# EAGLE schematic zephyreye_rev2 (EAGLE 5.06)
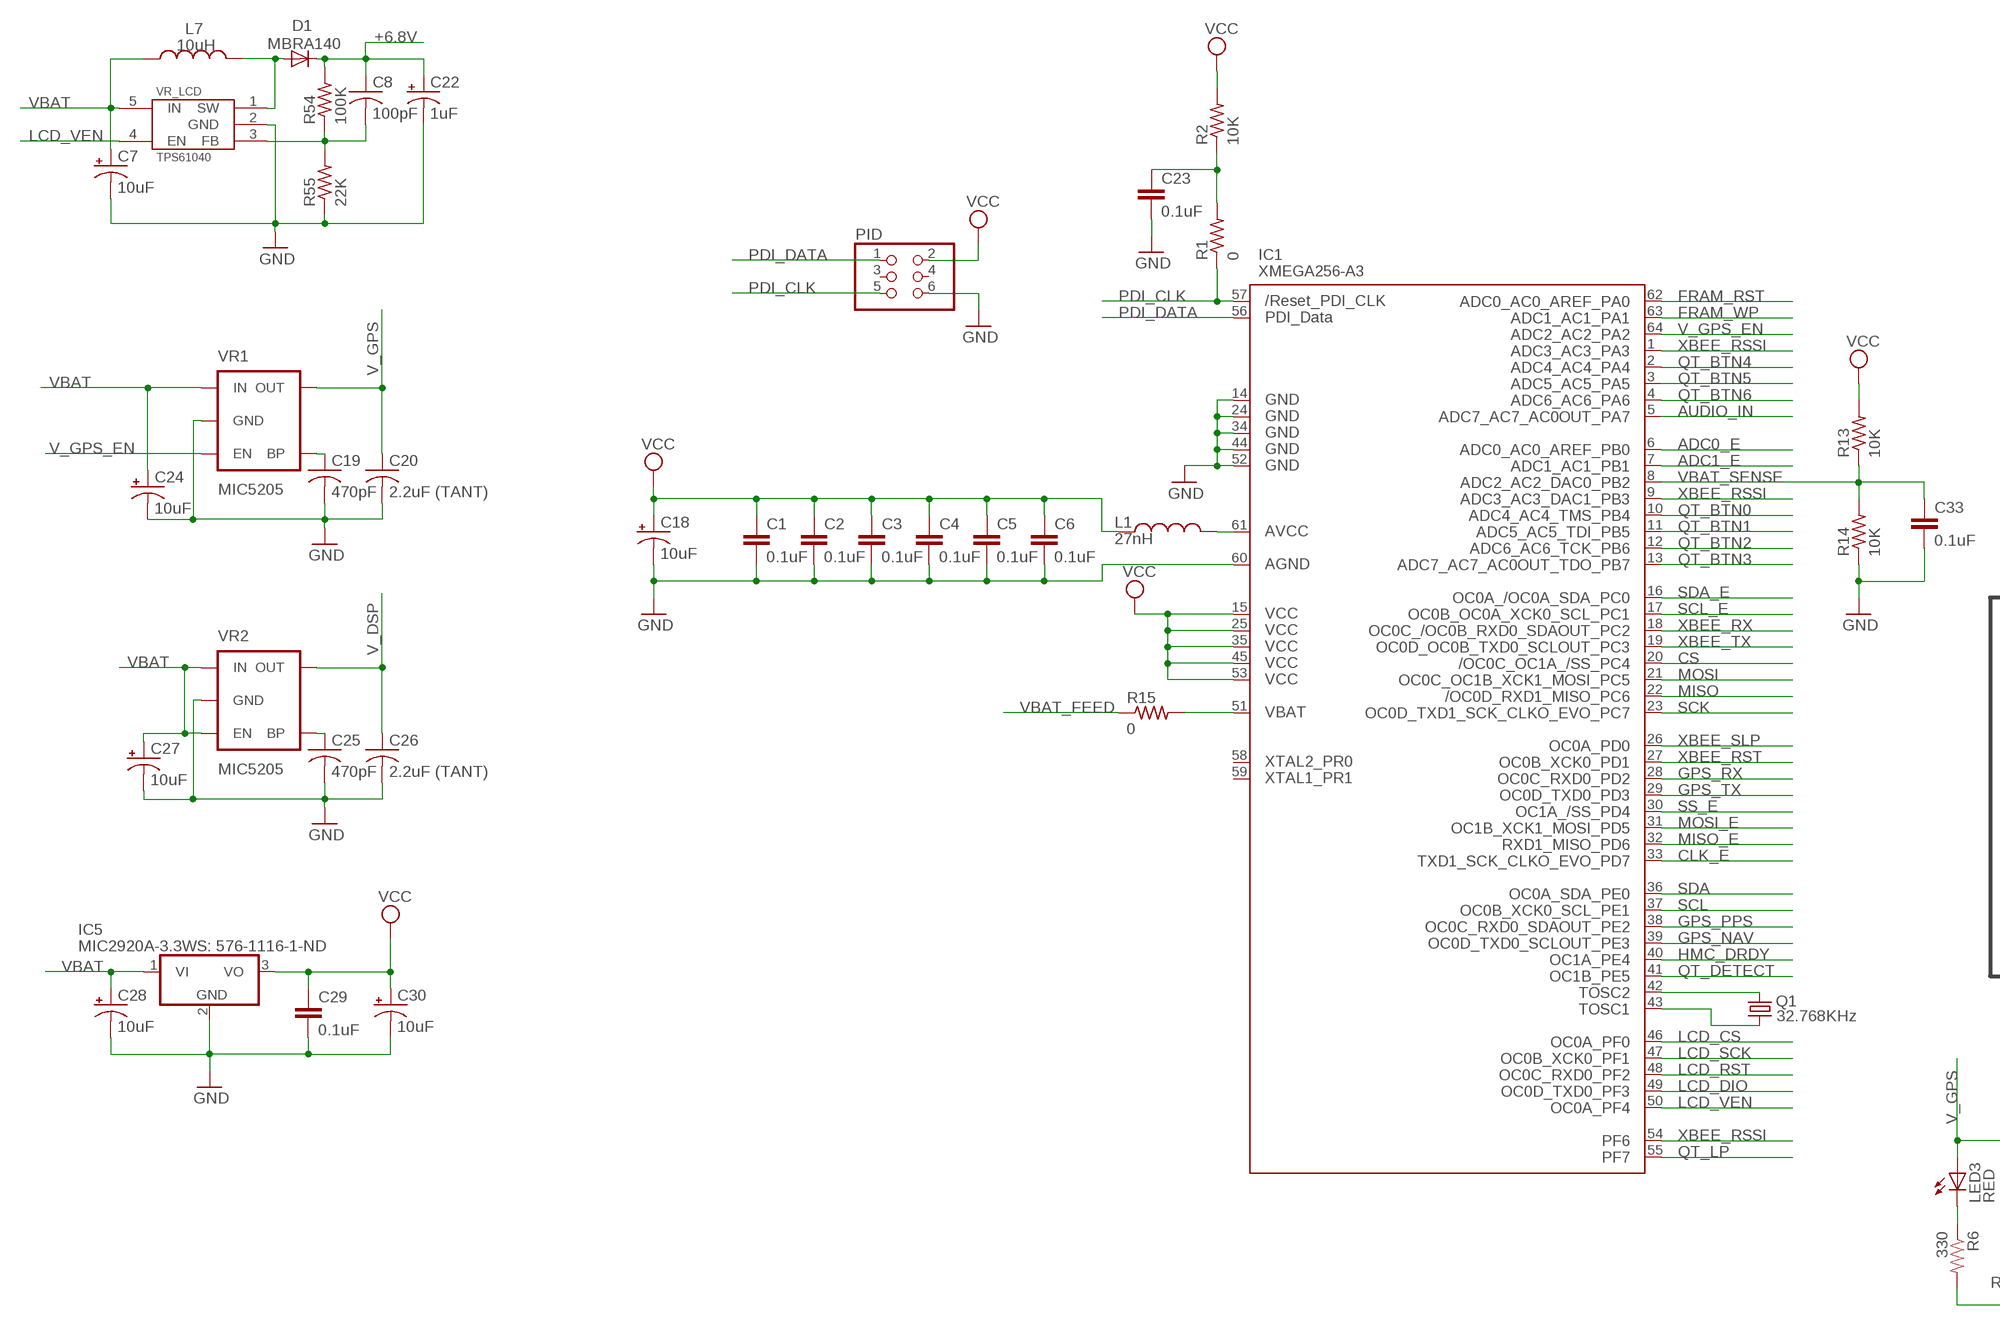
[diagram p0: schematic, sheet 1, part 1 of 2]
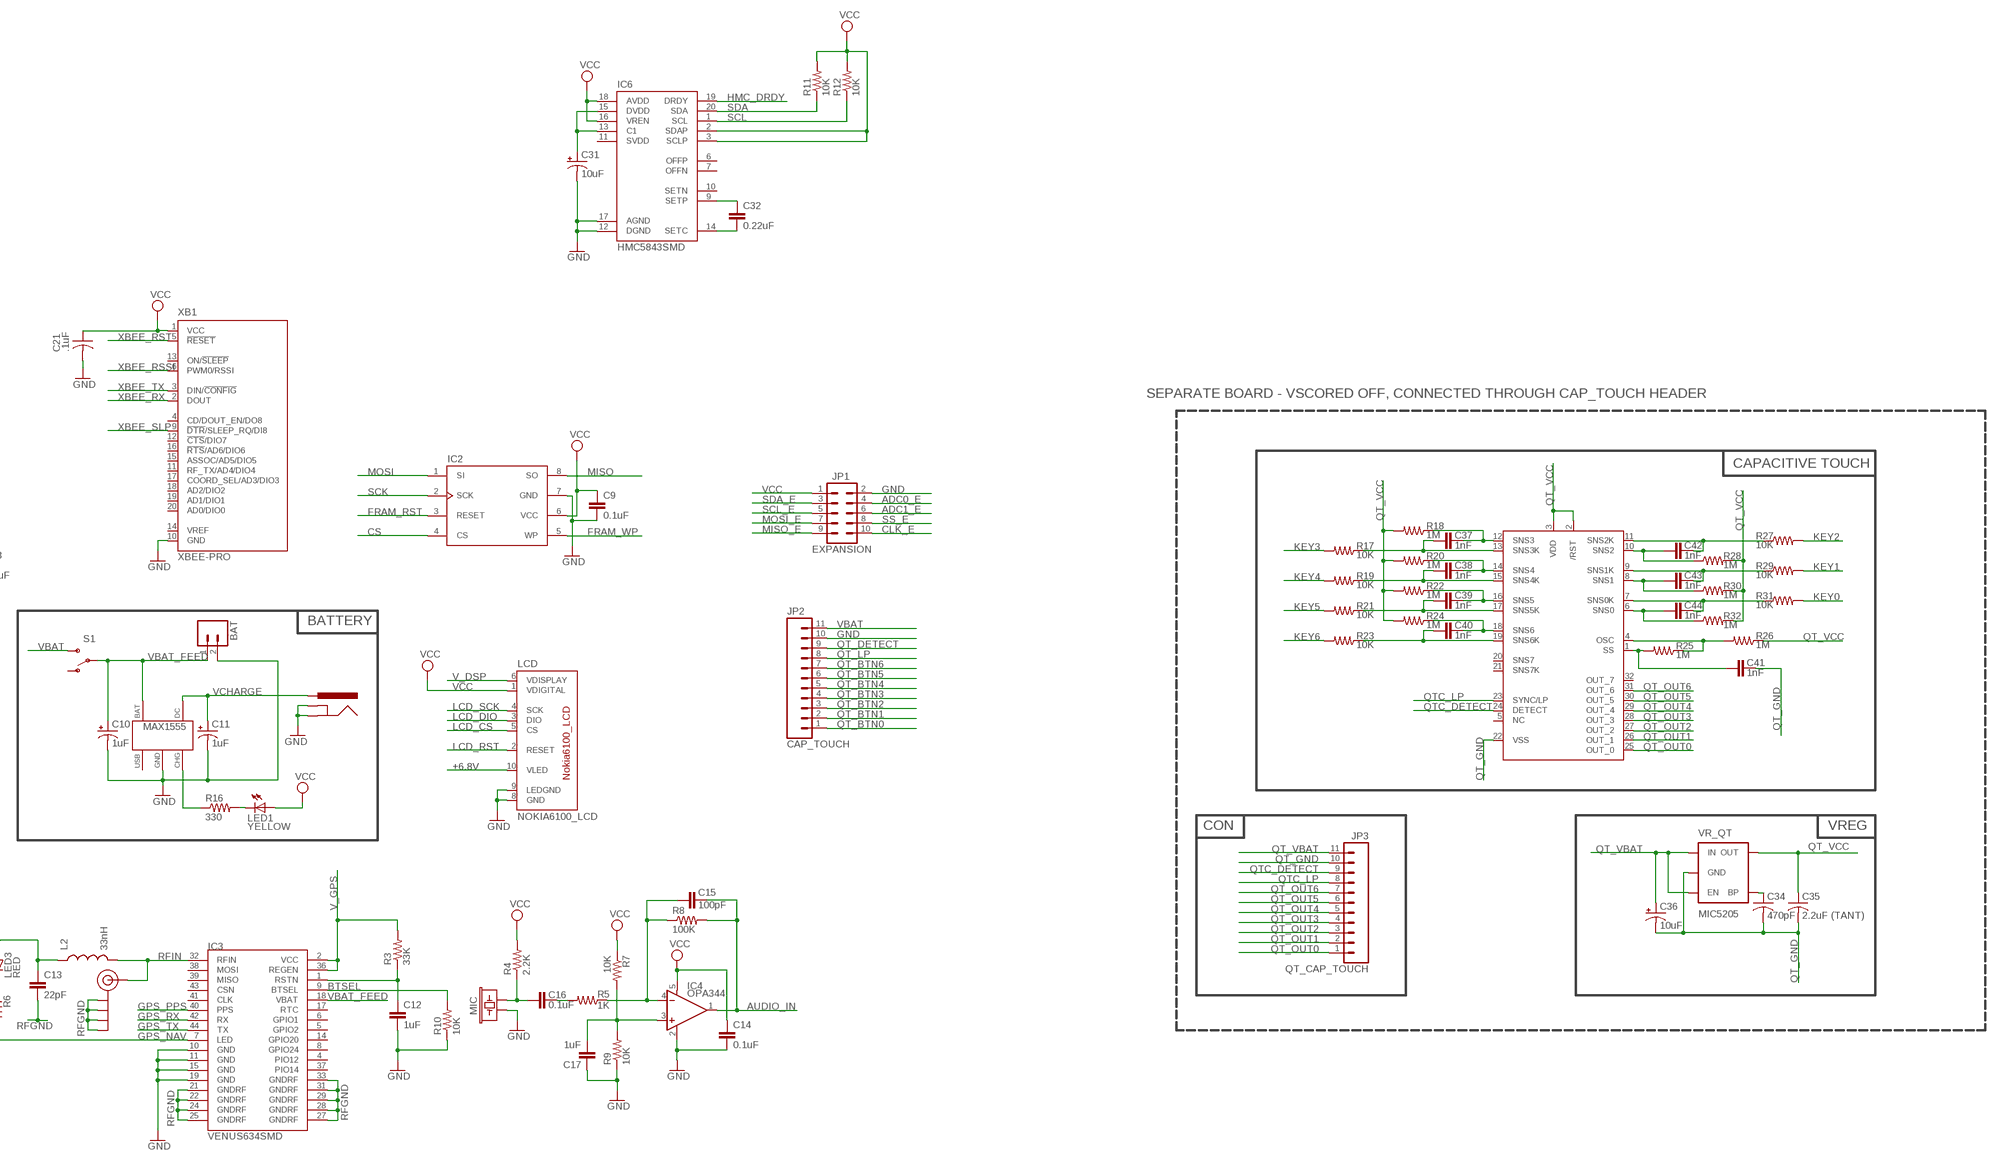
[diagram p1: schematic, sheet 1, part 2 of 2]

## Parts
BAT  M02-JST-2MM-SMT  [S2B-PH]
C1  0.1uF  CAP0805  [0805]
C2  0.1uF  CAP0805  [0805]
C3  0.1uF  CAP0805  [0805]
C4  0.1uF  CAP0805  [0805]
C5  0.1uF  CAP0805  [0805]
C6  0.1uF  CAP0805  [0805]
C7  10uF  CAP_POL1206  [EIA3216]
C8  100pF  C-USC0603K  [C0603K]
C9  0.1uF  CAP0805  [0805]
C10  1uF  CAP_POL1206  [EIA3216]
C11  1uF  CAP_POL1206  [EIA3216]
C12  1uF  CAP0402  [C0402]
C13  22pF  CAP0402  [C0402]
C14  0.1uF  CAP0402  [C0402]
C15  100pF  CAP0402  [C0402]
C16  0.1uF  CAP0402  [C0402]
C17  1uF  CAP0402  [C0402]
C18  10uF  CAP_POL1206  [EIA3216]
C19  470pF  C-USC0603K  [C0603K]
C20  2.2uF (TANT)  C-USC0603K  [C0603K]
C21  .1uF  C-USC0603K  [C0603K]
C22  1uF  CAP_POL1206  [EIA3216]
C23  0.1uF  CAP0805  [0805]
C24  10uF  CAP_POL1206  [EIA3216]
C25  470pF  C-USC0603K  [C0603K]
C26  2.2uF (TANT)  C-USC0603K  [C0603K]
C27  10uF  CAP_POL1206  [EIA3216]
C28  10uF  CAP_POL1206  [EIA3216]
C29  0.1uF  CAP0402  [C0402]
C30  10uF  CAP_POL1206  [EIA3216]
C31  10uF  CAP_POL1206  [EIA3216]
C32  0.22uF  CAP0805  [0805]
C33  0.1uF  CAP0805  [0805]
C34  470pF  C-USC0603K  [C0603K]
C35  2.2uF (TANT)  C-USC0603K  [C0603K]
C36  10uF  CAP_POL1206  [EIA3216]
C37  1nF  CAP0402  [C0402]
C38  1nF  CAP0402  [C0402]
C39  1nF  CAP0402  [C0402]
C40  1nF  CAP0402  [C0402]
C41  1nF  CAP0402  [C0402]
C42  1nF  CAP0402  [C0402]
C43  1nF  CAP0402  [C0402]
C44  1nF  CAP0402  [C0402]
D1  MBRA140  DIODE-DO214AC  [DO214AC]
IC1  XMEGA256-A3  AVR_XMEGA_A3B_64A  [TQFP64]
IC2  DATAFLASH  ATMEL_DATA_FLASH  [SO08WIDE]
IC3  VENUS634SMD  [LGA44]
IC4  OPA344  [SOT23-5]
IC5  MIC2920A-3.3WS: 576-1116-1-ND  MCP1703DB  [SOT223]
IC6  HMC5843SMD  [LPCC20]
J$1  SMA_EDGE  [SMA-EDGE]
JP1  EXPANSION  M05X2RA  [2X5-RA]
JP2  CAP_TOUCH  M11LOCK  [1X11_LOCK]
JP3  QT_CAP_TOUCH  M11LOCK  [1X11_LOCK]
L1  27nH  INDUCTOR0402  [C0402]
L2  33nH  INDUCTOR0402  [C0402]
L7  10uH  INDUCTOR0603  [0603]
LCD  NOKIA6100_LCD  [NOKIA6100_LCD]
LED1  YELLOW  LED1206  [LED-1206]
LED3  RED  LED0603  [LED-0603]
MAX1555  MAX1555  [SOT23-5]
MIC  MIC9.7MM  [MIC-9.7MM]
PID  PINHD-2X3  [2X03]
PWR  POWER_JACKPTH  [POWER_JACK_PTH]
Q1  32.768KHz  CRYSTAL32-SMD  [CRYSTAL-32KHZ-SMD]
R1  0  R-US_R0805  [R0805]
R2  10K  R-US_R0805  [R0805]
R3  33K  RESISTOR0402  [C0402]
R4  2.2K  RESISTOR0402  [C0402]
R5  1K  RESISTOR0402  [C0402]
R6  330  RESISTOR0402  [C0402]
R7  10K  RESISTOR0402  [C0402]
R8  100K  RESISTOR0402  [C0402]
R9  10K  RESISTOR0402  [C0402]
R10  10K  RESISTOR0402  [C0402]
R11  10K  R-US_R0603  [R0603]
R12  10K  R-US_R0603  [R0603]
R13  10K  R-US_R0603  [R0603]
R14  10K  R-US_R0603  [R0603]
R15  0  R-US_R0805  [R0805]
R16  330  R-US_R0603  [R0603]
R17  10K  RESISTOR0402  [C0402]
R18  1M  RESISTOR0402  [C0402]
R19  10K  RESISTOR0402  [C0402]
R20  1M  RESISTOR0402  [C0402]
R21  10K  RESISTOR0402  [C0402]
R22  1M  RESISTOR0402  [C0402]
R23  10K  RESISTOR0402  [C0402]
R24  1M  RESISTOR0402  [C0402]
R25  1M  RESISTOR0402  [C0402]
R26  1M  RESISTOR0402  [C0402]
R27  10K  RESISTOR0402  [C0402]
R28  1M  RESISTOR0402  [C0402]
R29  10K  RESISTOR0402  [C0402]
R30  1M  RESISTOR0402  [C0402]
R31  10K  RESISTOR0402  [C0402]
R32  1M  RESISTOR0402  [C0402]
R54  100K  R-US_R0603  [R0603]
R55  22K  R-US_R0603  [R0603]
S1  SWITCH-SPSTSMD2  [SWITCH-SPDT-SMD]
U$1  QT1081  [QFN-32]
VR1  MIC5205  V_REG_LDOSMD  [SOT23-5]
VR2  MIC5205  V_REG_LDOSMD  [SOT23-5]
VR_LCD  TPS61040  [SOT23-5]
VR_QT  MIC5205  V_REG_LDOSMD  [SOT23-5]
XB1  XBEE-PRO  [XBEE-PRO]

## Nets
+6.8V: C8.1 C22.A(+) D1.C LCD.10(VLED) R54.2
ADC0_E: IC1.6(PB0) JP1.4
ADC1_E: IC1.7(PB1) JP1.6
AUDIO_IN: C15.2 IC1.5(PA7) IC4.1(OUT) R8.2
BTSEL: IC3.9(BTSEL) R10.2
CHG: MAX1555.3(CHG) R16.1
CHRG_LED_FEED: LED1.C R16.2
CLK_E: IC1.33(PD7) JP1.10
CS: IC1.20(PC4) IC2.4(CS)
FRAM_RST: IC1.62(PA0) IC2.3(RESET)
FRAM_WP: IC1.63(PA1) IC2.5(WP)
GND: BAT.2 C1.2 C2.2 C3.2 C4.2 C5.2 C6.2 C7.C(-) C9.2 C10.C(-) C11.C(-) C12.2 C14.2 C17.1 C18.C(-) C19.2 C20.2 C21.2 C22.C(-) C23.2 C24.C(-) C25.2 C26.2 C27.C(-) C28.C(-) C29.2 C30.C(-) C31.C(-) C33.2 IC1.14(GND1) IC1.24(GND2) IC1.34(GND3) IC1.44(GND4) IC1.52(GND5) IC1.60(AGND) IC2.7(GND) IC3.10(GND) IC3.11(GND) IC3.15(GND) IC3.19(GND) IC4.2(V-) IC5.2(GND) IC6.12(DGND) IC6.17(AGND) JP1.2 JP2.10 LCD.8(GND) LCD.9(LEDGND) MAX1555.2(GND) MIC.1 PID.6 PWR.GND PWR.GNDBREAK R9.1 R10.1 R14.1 R55.1 VR1.2(GND) VR2.2(GND) VR_LCD.2(GND) XB1.10(GND)
GPS_NAV: IC1.39(PE3) IC3.7(LED) R6.2
GPS_PPS: IC1.38(PE2) IC3.40(PPS)
GPS_RX: IC1.28(PD2) IC3.42(RX)
GPS_TX: IC1.29(PD3) IC3.44(TX)
HMC_DRDY: IC1.40(PE4) IC6.19(DRDY)
HMC_DVDD: C31.A(+) IC6.13(C1) IC6.15(DVDD)
HMC_SETC: C32.2 IC6.14(SETC)
HMC_SETP: C32.1 IC6.9(SETP)
KEY0: R31.2
KEY1: R29.2
KEY2: R27.2
KEY3: R17.2
KEY4: R19.2
KEY5: R21.2
KEY6: R23.2
LCD_CS: IC1.46(PF0) LCD.5(CS)
LCD_DIO: IC1.49(PF3) LCD.3(DIO)
LCD_RST: IC1.48(PF2) LCD.2(RESET)
LCD_SCK: IC1.47(PF1) LCD.4(SCK)
LCD_VEN: IC1.50(PF4) VR_LCD.4(EN)
LED3_FEED: LED3.C R6.1
MIC_FILT1: C16.2 R5.2
MIC_OPAMP_IN: C15.1 IC4.4(-IN) R5.1 R8.1
MIC_OPAMP_VIRT_GND: C17.2 IC4.3(+IN) R7.2 R9.2
MIC_RAW: C16.1 MIC.2 R4.1
MISO: IC1.22(PC6) IC2.8(SO)
MISO_E: IC1.32(PD6) JP1.9
MOSI: IC1.21(PC5) IC2.1(SI)
MOSI_E: IC1.31(PD5) JP1.7
N$1: IC1.51(VBAT) R15.2
N$2: R25.1 R26.2 U$1.4(OSC)
N$4: IC1.61(AVCC) L1.2
N$5: C41.2 R25.2 U$1.1(SS)
PDI_CLK: IC1.57(RESET) PID.5 R1.1
PDI_DATA: IC1.56(PDI_DATA) PID.1
QT_BTN0: IC1.10(PB4) JP2.1
QT_BTN1: IC1.11(PB5) JP2.2
QT_BTN2: IC1.12(PB6) JP2.3
QT_BTN3: IC1.13(PB7) JP2.4
QT_BTN4: IC1.2(PA4) JP2.5
QT_BTN5: IC1.3(PA5) JP2.6
QT_BTN6: IC1.4(PA6) JP2.7
QT_DETECT: IC1.41(PE5) JP2.9
QT_GND: C34.2 C35.2 C36.C(-) C41.1 JP3.10 U$1.22(VSS) VR_QT.2(GND)
QT_LP: IC1.55(PF7) JP2.8
QT_OUT0: JP3.1 U$1.25(OUT_0)
QT_OUT1: JP3.2 U$1.26(OUT_1)
QT_OUT2: JP3.3 U$1.27(OUT_2)
QT_OUT3: JP3.4 U$1.28(OUT_3)
QT_OUT4: JP3.5 U$1.29(OUT_4)
QT_OUT5: JP3.6 U$1.30(OUT_5)
QT_OUT6: JP3.7 U$1.31(OUT_6)
QT_VBAT: C36.A(+) JP3.11 VR_QT.1(IN) VR_QT.3(EN)
QT_VCC: C35.1 R18.2 R20.2 R22.2 R24.2 R26.1 R28.2 R30.2 R32.2 U$1.2(/RST) U$1.3(VDD) VR_QT.5(OUT)
QTC_DETECT: JP3.9 U$1.24(DETECT)
QTC_LP: JP3.8 U$1.23(SYNC/LP)
RFGND: C13.2 IC3.21(GNDRF) IC3.22(GNDRF) IC3.24(GNDRF) IC3.25(GNDRF) IC3.27(GNDRF) IC3.28(GNDRF) IC3.29(GNDRF) IC3.31(GNDRF) IC3.33(GNDRF) J$1.GND@0(GND) J$1.GND@1(GND) J$1.GND@2(GND) J$1.GND@3(GND)
RFIN: IC3.32(RFIN) J$1.SIG(SIGNAL) L2.2
RST_FEED: C23.1 R1.2 R2.1
RSTN: C12.1 IC3.1(RSTN) R3.1
SCK: IC1.23(PC7) IC2.2(SCK)
SCL: IC1.37(PE1) IC6.1(SCL) R12.1
SCL_E: IC1.17(PC1) JP1.5
SDA: IC1.36(PE0) IC6.20(SDA) R11.1
SDA_E: IC1.16(PC0) JP1.3
SNS0: C44.2 R32.1 U$1.6(SNS0)
SNS0K: C44.1 R31.1 U$1.7(SNS0K)
SNS1: C43.2 R30.1 U$1.8(SNS1)
SNS1K: C43.1 R29.1 U$1.9(SNS1K)
SNS2: C42.2 R28.1 U$1.10(SNS2)
SNS2K: C42.1 R27.1 U$1.11(SNS2K)
SNS3: C37.2 R18.1 U$1.12(SNS3)
SNS3K: C37.1 R17.1 U$1.13(SNS3K)
SNS4: C38.2 R20.1 U$1.14(SNS4)
SNS4K: C38.1 R19.1 U$1.15(SNS4K)
SNS5: C39.2 R22.1 U$1.16(SNS5)
SNS5K: C39.1 R21.1 U$1.17(SNS5K)
SNS6: C40.2 R24.1 U$1.18(SNS6)
SNS6K: C40.1 R23.1 U$1.19(SNS6K)
SS_E: IC1.30(PD4) JP1.8
TOSC1: IC1.43(TOSC1) Q1.X1
TOSC2: IC1.42(TOSC2) Q1.X2
V_DSP: C26.1 LCD.6(VDISPLAY) VR2.5(OUT)
V_GPS: C13.1 C20.1 IC3.2(VCC) IC3.36(REGEN) L2.1 LED3.A R3.2 VR1.5(OUT)
V_GPS_EN: IC1.64(PA2) VR1.3(EN)
VBAT: C7.A(+) C24.A(+) C27.A(+) C28.A(+) IC5.1(VI) JP2.11 L7.1 S1.3(S) VR1.1(IN) VR2.1(IN) VR2.3(EN) VR_LCD.5(IN)
VBAT_FEED: BAT.1 C10.A(+) IC3.18(VBAT) MAX1555.5(BAT) R15.1 S1.2(P)
VBAT_SENSE: C33.1 IC1.8(PB2) R13.1 R14.2
VCC: C1.1 C2.1 C3.1 C4.1 C5.1 C6.1 C9.1 C14.1 C18.A(+) C21.1 C29.1 C30.A(+) IC1.15(VCC1) IC1.25(VCC2) IC1.35(VCC3) IC1.45(VCC4) IC1.53(VCC5) IC2.6(VCC) IC4.5(V+) IC5.3(VO) IC6.2(SDAP) IC6.3(SCLP) IC6.16(VREN) IC6.18(AVDD) JP1.1 L1.1 LCD.1(VDIGITAL) LED1.A PID.2 R2.2 R4.2 R7.1 R11.2 R12.2 R13.2 XB1.1(VCC)
VCHARGE: C11.A(+) MAX1555.4(DC) PWR.PWR
VR1_BP: C19.1 VR1.4(BP)
VR1_BP1: C25.1 VR2.4(BP)
VR_LCD_FB: C8.2 R54.1 R55.2 VR_LCD.3(FB)
VR_LCD_SW: D1.A L7.2 VR_LCD.1(SW)
VRQT_BP: C34.1 VR_QT.4(BP)
XBEE_RSSI: IC1.1(PA3) IC1.9(PB3) IC1.54(PF6) XB1.6(PWM0/RSSI)
XBEE_RST: IC1.27(PD1) XB1.5(!RESET)
XBEE_RX: IC1.18(PC2) XB1.2(DOUT)
XBEE_SLP: IC1.26(PD0) XB1.9(!DTR!/SLEEP_RQ/DI8)
XBEE_TX: IC1.19(PC3) XB1.3(DIN/!CONFIG)
Unconnected: IC1.58(PR0) IC1.59(PR1) IC3.4(PIO12) IC3.5(GPIO2) IC3.6(GPIO1) IC3.8(GPIO24) IC3.14(GPIO20) IC3.17(RTC) IC3.37(PIO14) IC3.38(MOSI) IC3.39(MISO) IC3.41(CLK) IC3.43(CSN) IC6.6(OFFP) IC6.7(OFFN) IC6.10(SETN) IC6.11(SVDD) MAX1555.1(USB) PID.3 PID.4 S1.1(O) U$1.5(NC) U$1.20(SNS7) U$1.21(SNS7K) U$1.32(OUT_7) XB1.4(CD/DOUT_EN/DO8) XB1.11(RF_TX/AD4/DIO4) XB1.12(!CTS!/DIO7) XB1.13(ON/!SLEEP) XB1.14(VREF) XB1.15(ASSOC/AD5/DIO5) XB1.16(!RTS!/AD6/DIO6) XB1.17(COORD_SEL/AD3/DIO3) XB1.18(AD2/DIO2) XB1.19(AD1/DIO1) XB1.20(AD0/DIO0)

## Notes on the sheet
- SEPARATE BOARD - VSCORED OFF, CONNECTED THROUGH CAP_TOUCH HEADER
- CAPACITIVE TOUCH
- BATTERY
- CON | VREG

## Library data of the parts
BAT = SparkFun:M02: Header 2 Standard 2-pin 0.1" header. Use with straight break away headers (SKU : PRT-00116), right angle break away headers (PRT-00553), swiss pins (PRT-00743), machine pins (PRT-00117), and female headers (PRT-00115). Molex polarized connector foot print use with SKU : PRT-08233 with associated crimp pins and housings.
C1-C6 C9 C12-C17 C23 C29 C32 C33 C37-C44 = SparkFun:CAP: Capacitor Standard 0603 ceramic capacitor, and 0.1" leaded capacitor.
C7 C10 C11 C22 C24 C27 C28 C30 C31 C36 = SparkFun-3-2-07:CAP_POL: Capacitor Polarized These are standard SMD and PTH capacitors. Normally 10uF, 47uF, and 100uF in electrolytic and tantalum varieties. Always verify the external diameter of the through hole cap, it varies with capacity, voltage, and manufacturer. The EIA devices should be standard.
C8 C19-C21 C25 C26 C34 C35 = rcl:C-US: CAPACITOR, American symbol
C18 = SparkFun:CAP_POL: Capacitor Polarized These are standard SMD and PTH capacitors. Normally 10uF, 47uF, and 100uF in electrolytic and tantalum varieties. Always verify the external diameter of the through hole cap, it varies with capacity, voltage, and manufacturer. The EIA devices should be standard.
D1 = diode:DIODE-: DIODE
IC1 = xmega:AVR_XMEGA_A3B_: Device for Atmel AVR XMEGA A3B Series
IC2 = SparkFunEagle-6-6-07:ATMEL_DATA_FLASH: 16Mbit EEPROM DataFlash Footprint needs touching up. Spark Fun Electronics SKU : COM-00301
IC3 = SparkFun:VENUS634: Venus634 from SkyTraq
IC4 = SparkFun:OPA344
IC5 = linear:MCP1703: 250 mA, 16V, Low Quiescent Current LDO Regulator Source: http://ww1.microchip.com/downloads/en/DeviceDoc/22049b.pdf
IC6 = SparkFun:HMC5843
J$1 = SparkFun:SMA_EDGE: SMA Antenna Connector End launch SMA connector. The paste layer has been removed so that the connector can be hand soldered onto the board after reflow.
JP1 = SparkFun:M05X2: Header 5x2 Standard 10-pin dual row 0.1" header. Commonly used with AVR-ISP. Use with Spark Fun Electronics SKU: PRT-00778
JP2 JP3 = SparkFun:M11: Header 11 Standard 11-pin 0.1" header. Use with straight break away headers (SKU : PRT-00116), right angle break away headers (PRT-00553), swiss pins (PRT-00743), machine pins (PRT-00117), and female headers (PRT-00115).
L1 L2 = SparkFun:INDUCTOR: Inductors Basic Inductor/Choke - 0603 and 1206. Footprints are not proven and vary greatly between part numbers.
L7 = SparkFun-3-2-07:INDUCTOR: Inductors Basic Inductor/Choke - 0603 and 1206. Footprints are not proven and vary greatly between part numbers.
LCD = SparkFun:NOKIA6100_LCD: Nokia 6100 Color LCD Schematic element and footprint production proven but could use some touching up. Spark Fun Electronics SKU : LCD-00569. Mating SMD connector : LCD-00570
LED1 = SparkFun-3-2-07:LED: LEDs
LED3 = SparkFun:LED: LEDs
MAX1555 = brad:MAX1555
MIC = SparkFun:MIC: Microphone Omni-directional electret microphone. 9.7mm standard diameter.
PID = pinhead:PINHD-2X3: PIN HEADER
PWR = SparkFunEagle-6-6-07:POWER_JACK: Power Jack This is the standard 5.5mm barrel jack for power. The PTH is the most common, proven, reliable, footprint. All others are experimental. The Slot footprint only works if the mill layer is transmitted to the PCB fab house so be warned. Spark Fun Electronics SKU : PRT-00119. Mating wall wart : TOL-00298 (and others)
Q1 = SparkFun:CRYSTAL: Crystals Various standard crystals. Proven footprints. Spark Fun Electronics SKU : COM-00534
R1 R2 R11-R16 R54 R55 = rcl:R-US_: RESISTOR, American symbol
R3-R10 R17-R32 = SparkFun:RESISTOR: Resistor Basic schematic elements and footprints for 0603, 1206, and PTH 1/10th watt (small) resistors.
S1 = SparkFun:SWITCH-SPST: SPST Switch Simple slide switch. Spark Fun Electronics SKU : COM-00102
U$1 = qtouch:QT1081: The QTouch QT1081 chip from Atmel - Formerly from Quantum Research Group - Pretty simple: You connect properly sized copper pads to the pins as shown in the datasheet, and you get eight logic level outputs. - Digikey: 427-1127-1-ND
VR1 VR2 VR_QT = SparkFun-3-2-07:V_REG_LDO: Voltage Regulator LDO Standard 150mA LDO voltage regulator in SOT-23 layout. Micrel part MIC5205. BP (by-pass) pin is used to lower output noise with 470pF cap.
VR_LCD = brad:TPS61040
XB1 = maxstream:XBEE: XBee (TM) /XBee-PRO(TM) OEM RF Modules Source: MaxStream, Inc. xbee_productmanual.pdf